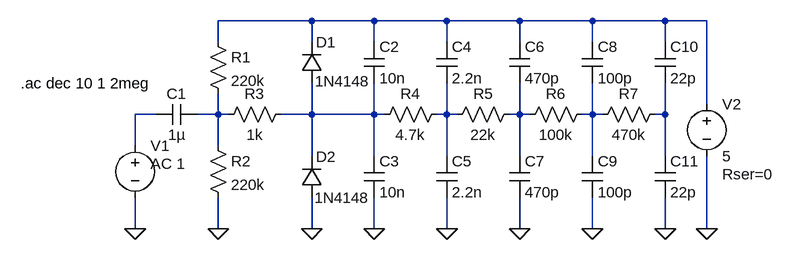
[diagram p0: schematic passive filter high order.asc]
passive filter high order.asc, the LTspice schematic file:
Version 4
SHEET 1 884 680
WIRE 160 16 16 16
WIRE 256 16 160 16
WIRE 368 16 256 16
WIRE 480 16 368 16
WIRE 592 16 480 16
WIRE 704 16 592 16
WIRE 768 16 704 16
WIRE 16 48 16 16
WIRE 160 48 160 16
WIRE 256 48 256 16
WIRE 368 48 368 16
WIRE 480 48 480 16
WIRE 592 48 592 16
WIRE 704 48 704 16
WIRE 768 144 768 16
WIRE -80 160 -112 160
WIRE 16 160 16 128
WIRE 16 160 -16 160
WIRE 32 160 16 160
WIRE 160 160 160 112
WIRE 160 160 112 160
WIRE 256 160 256 112
WIRE 256 160 160 160
WIRE 272 160 256 160
WIRE 368 160 368 112
WIRE 368 160 352 160
WIRE 384 160 368 160
WIRE 480 160 480 112
WIRE 480 160 464 160
WIRE 496 160 480 160
WIRE 592 160 592 112
WIRE 592 160 576 160
WIRE 608 160 592 160
WIRE 704 160 704 112
WIRE 704 160 688 160
WIRE -112 208 -112 160
WIRE 16 208 16 160
WIRE 160 224 160 160
WIRE 256 224 256 160
WIRE 368 224 368 160
WIRE 480 224 480 160
WIRE 592 224 592 160
WIRE 704 224 704 160
WIRE -112 336 -112 288
WIRE 16 336 16 288
WIRE 160 336 160 288
WIRE 256 336 256 288
WIRE 368 336 368 288
WIRE 480 336 480 288
WIRE 592 336 592 288
WIRE 704 336 704 288
WIRE 768 336 768 224
FLAG 256 336 0
FLAG -112 336 0
FLAG 768 336 0
FLAG 368 336 0
FLAG 480 336 0
FLAG 592 336 0
FLAG 16 336 0
FLAG 704 336 0
FLAG 160 336 0
SYMBOL cap -16 144 R90
WINDOW 0 0 32 VBottom 2
WINDOW 3 32 32 VTop 2
SYMATTR InstName C1
SYMATTR Value 1µ
SYMBOL cap 240 48 R0
SYMATTR InstName C2
SYMATTR Value 10n
SYMBOL cap 240 224 R0
SYMATTR InstName C3
SYMATTR Value 10n
SYMBOL res 0 32 R0
SYMATTR InstName R1
SYMATTR Value 220k
SYMBOL res 0 192 R0
SYMATTR InstName R2
SYMATTR Value 220k
SYMBOL res 128 144 R90
WINDOW 0 0 56 VBottom 2
WINDOW 3 32 56 VTop 2
SYMATTR InstName R3
SYMATTR Value 1k
SYMBOL voltage -112 192 R0
WINDOW 123 24 44 Left 2
WINDOW 39 0 0 Left 2
SYMATTR Value2 AC 1
SYMATTR InstName V1
SYMATTR Value ""
SYMBOL voltage 768 128 R0
WINDOW 123 0 0 Left 2
WINDOW 39 24 124 Left 2
SYMATTR SpiceLine Rser=0
SYMATTR InstName V2
SYMATTR Value 5
SYMBOL cap 352 48 R0
SYMATTR InstName C4
SYMATTR Value 2.2n
SYMBOL cap 352 224 R0
SYMATTR InstName C5
SYMATTR Value 2.2n
SYMBOL res 368 144 R90
WINDOW 0 0 56 VBottom 2
WINDOW 3 32 56 VTop 2
SYMATTR InstName R4
SYMATTR Value 4.7k
SYMBOL res 480 144 R90
WINDOW 0 0 56 VBottom 2
WINDOW 3 32 56 VTop 2
SYMATTR InstName R5
SYMATTR Value 22k
SYMBOL cap 464 48 R0
SYMATTR InstName C6
SYMATTR Value 470p
SYMBOL cap 464 224 R0
SYMATTR InstName C7
SYMATTR Value 470p
SYMBOL res 592 144 R90
WINDOW 0 0 56 VBottom 2
WINDOW 3 32 56 VTop 2
SYMATTR InstName R6
SYMATTR Value 100k
SYMBOL cap 576 48 R0
SYMATTR InstName C8
SYMATTR Value 100p
SYMBOL cap 576 224 R0
SYMATTR InstName C9
SYMATTR Value 100p
SYMBOL res 704 144 R90
WINDOW 0 0 56 VBottom 2
WINDOW 3 32 56 VTop 2
SYMATTR InstName R7
SYMATTR Value 470k
SYMBOL cap 688 48 R0
SYMATTR InstName C10
SYMATTR Value 22p
SYMBOL cap 688 224 R0
SYMATTR InstName C11
SYMATTR Value 22p
SYMBOL diode 176 112 R180
WINDOW 0 -21 63 Left 2
WINDOW 3 -74 3 Left 2
SYMATTR InstName D1
SYMATTR Value 1N4148
SYMBOL diode 176 288 R180
WINDOW 0 -21 63 Left 2
WINDOW 3 -73 0 Left 2
SYMATTR InstName D2
SYMATTR Value 1N4148
TEXT -288 112 Left 2 !.ac dec 10 1 2meg

The netlist it stands for:
* passive filter high order.asc
C1 N003 N002 1µ
C2 N001 N004 10n
C3 N004 0 10n
R1 N001 N003 220k
R2 N003 0 220k
R3 N004 N003 1k
V1 N002 0 AC 1
V2 N001 0 5 Rser=0
C4 N001 N005 2.2n
C5 N005 0 2.2n
R4 N005 N004 4.7k
R5 N006 N005 22k
C6 N001 N006 470p
C7 N006 0 470p
R6 N007 N006 100k
C8 N001 N007 100p
C9 N007 0 100p
R7 N008 N007 470k
C10 N001 N008 22p
C11 N008 0 22p
D1 N004 N001 1N4148
D2 0 N004 1N4148
.model D D
.lib standard.dio
.ac dec 10 1 2meg
.backanno
.end